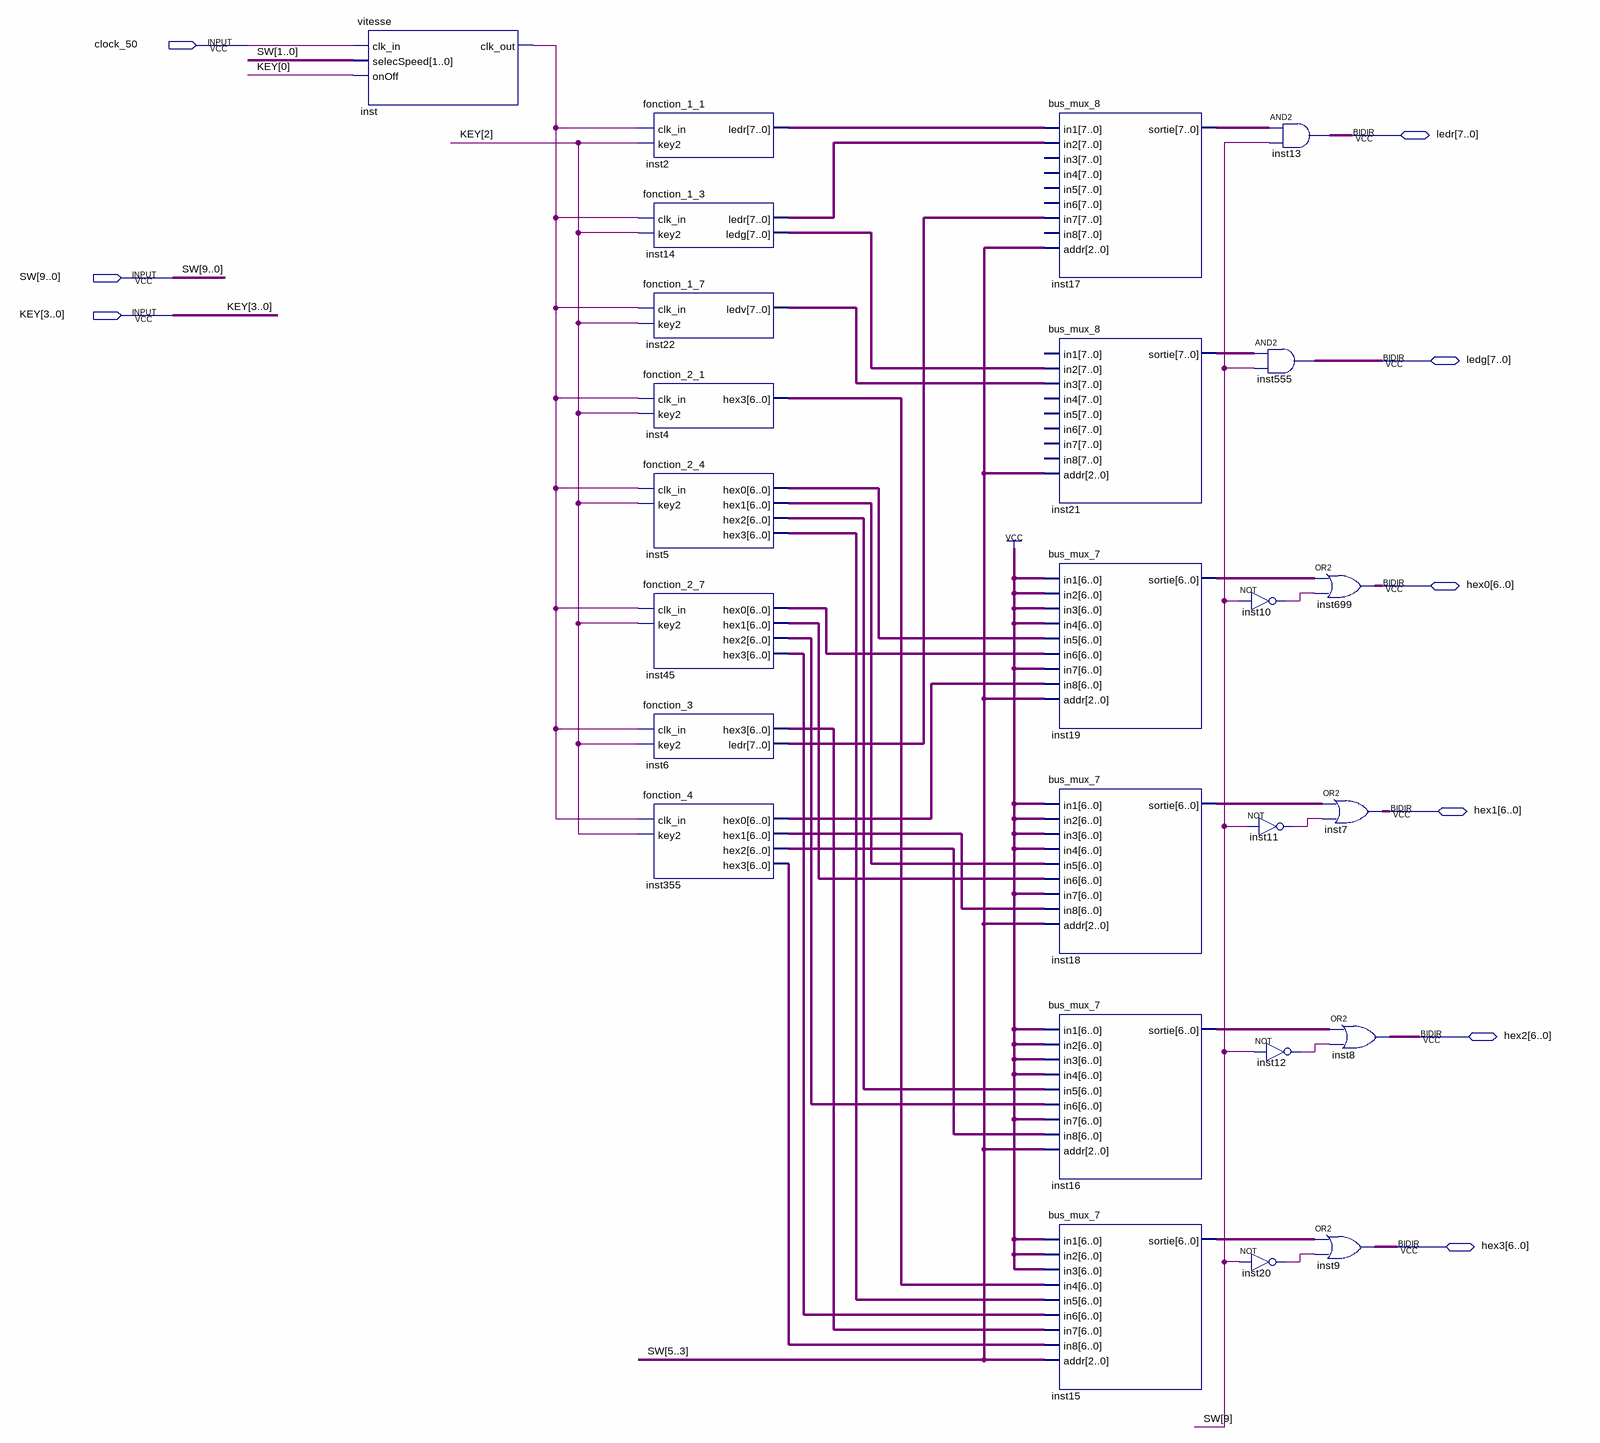
[diagram p0: schematic sheet]
// Quartus schematic top.bdf as structural Verilog: 25 symbols, 9 pins
module top (
  input  clock_50,
  input  [9:0] SW,
  input  [3:0] KEY,
  inout  [7:0] ledr,
  inout  [7:0] ledg,
  inout  [6:0] hex0,
  inout  [6:0] hex1,
  inout  [6:0] hex2,
  inout  [6:0] hex3
);

  wire inst10_out, inst11_out, inst12_out, inst20_out, inst_clk_out;
  wire [6:0] inst4_hex3, inst5_hex0, inst5_hex1, inst5_hex2, inst5_hex3, inst6_hex3, inst15_sortie,
       inst16_sortie, inst18_sortie, inst19_sortie, inst45_hex0, inst45_hex1, inst45_hex2, inst45_hex3,
       inst355_hex0, inst355_hex1, inst355_hex2, inst355_hex3;
  wire [7:0] inst2_ledr, inst6_ledr, inst14_ledg, inst14_ledr, inst17_sortie, inst21_sortie, inst22_ledv;

  vitesse inst (.clk_in(clock_50), .selecSpeed(SW[1:0]), .onOff(KEY[0]), .clk_out(inst_clk_out));
  fonction_1_1 inst2 (.clk_in(inst_clk_out), .key2(KEY[2]), .ledr(inst2_ledr));
  fonction_1_3 inst14 (.clk_in(inst_clk_out), .key2(KEY[2]), .ledr(inst14_ledr), .ledg(inst14_ledg));
  fonction_1_7 inst22 (.clk_in(inst_clk_out), .key2(KEY[2]), .ledv(inst22_ledv));
  fonction_2_1 inst4 (.clk_in(inst_clk_out), .key2(KEY[2]), .hex3(inst4_hex3));
  fonction_2_4 inst5 (
    .clk_in(inst_clk_out), .key2(KEY[2]), .hex0(inst5_hex0), .hex1(inst5_hex1), .hex2(inst5_hex2),
    .hex3(inst5_hex3));
  fonction_2_7 inst45 (
    .clk_in(inst_clk_out), .key2(KEY[2]), .hex0(inst45_hex0), .hex1(inst45_hex1), .hex2(inst45_hex2),
    .hex3(inst45_hex3));
  fonction_3 inst6 (.clk_in(inst_clk_out), .key2(KEY[2]), .hex3(inst6_hex3), .ledr(inst6_ledr));
  fonction_4 inst355 (
    .clk_in(inst_clk_out), .key2(KEY[2]), .hex0(inst355_hex0), .hex1(inst355_hex1), .hex2(inst355_hex2),
    .hex3(inst355_hex3));
  bus_mux_8 inst17 (
    .in1(inst2_ledr), .in2(inst14_ledr), .in7(inst6_ledr), .addr(SW[5:3]), .sortie(inst17_sortie));  // open: in3, in4, in5, in6, in8
  bus_mux_8 inst21 (
    .in2(inst14_ledg), .in3(inst22_ledv), .addr(SW[5:3]), .sortie(inst21_sortie));  // open: in1, in4, in5, in6, in7, in8
  bus_mux_7 inst19 (
    .in1({7{1'b1}}), .in2({7{1'b1}}), .in3({7{1'b1}}), .in4({7{1'b1}}), .in5(inst5_hex0), .in6(inst45_hex0),
    .in7({7{1'b1}}), .in8(inst355_hex0), .addr(SW[5:3]), .sortie(inst19_sortie));
  bus_mux_7 inst18 (
    .in1({7{1'b1}}), .in2({7{1'b1}}), .in3({7{1'b1}}), .in4({7{1'b1}}), .in5(inst5_hex1), .in6(inst45_hex1),
    .in7({7{1'b1}}), .in8(inst355_hex1), .addr(SW[5:3]), .sortie(inst18_sortie));
  bus_mux_7 inst16 (
    .in1({7{1'b1}}), .in2({7{1'b1}}), .in3({7{1'b1}}), .in4({7{1'b1}}), .in5(inst5_hex2), .in6(inst45_hex2),
    .in7({7{1'b1}}), .in8(inst355_hex2), .addr(SW[5:3]), .sortie(inst16_sortie));
  bus_mux_7 inst15 (
    .in1({7{1'b1}}), .in2({7{1'b1}}), .in3({7{1'b1}}), .in4(inst4_hex3), .in5(inst5_hex3), .in6(inst45_hex3),
    .in7(inst6_hex3), .in8(inst355_hex3), .addr(SW[5:3]), .sortie(inst15_sortie));
  assign ledr = inst17_sortie & {8{SW[9]}};  // AND2 inst13, 8 bits wide
  assign ledg = inst21_sortie & {8{SW[9]}};  // AND2 inst555, 8 bits wide
  not inst10 (inst10_out, SW[9]);
  not inst11 (inst11_out, SW[9]);
  not inst12 (inst12_out, SW[9]);
  not inst20 (inst20_out, SW[9]);
  assign hex0 = inst19_sortie | {7{inst10_out}};  // OR2 inst699, 7 bits wide
  assign hex1 = inst18_sortie | {7{inst11_out}};  // OR2 inst7, 7 bits wide
  assign hex2 = inst16_sortie | {7{inst12_out}};  // OR2 inst8, 7 bits wide
  assign hex3 = inst15_sortie | {7{inst20_out}};  // OR2 inst9, 7 bits wide
endmodule
